# Altium schematic sheet PongSchematic.SchDoc
size A4; CompanyName: HESSO; Address1: Route du Rawyl 47; Address2: 1950 Sion; Address3: Switzerland; PageSetup: Record=PageOptions|CenterHorizontal=True|CenterVertical=True|PrintScale=1.00|XCorrection=1.00|YCorrection=1.00|PrintKind=1|BorderSize=5000000|LeftOffset=0|BottomOffset=0|Orientation=2|PaperLength=1000|PaperWidth=1000|Scale=100|PaperSource=15|PrintQuality=1200|MediaType=1|DitherType=10|PrintScaleMode=1|PaperKind=A4|PaperIndex=9; ProjectName: Project Name
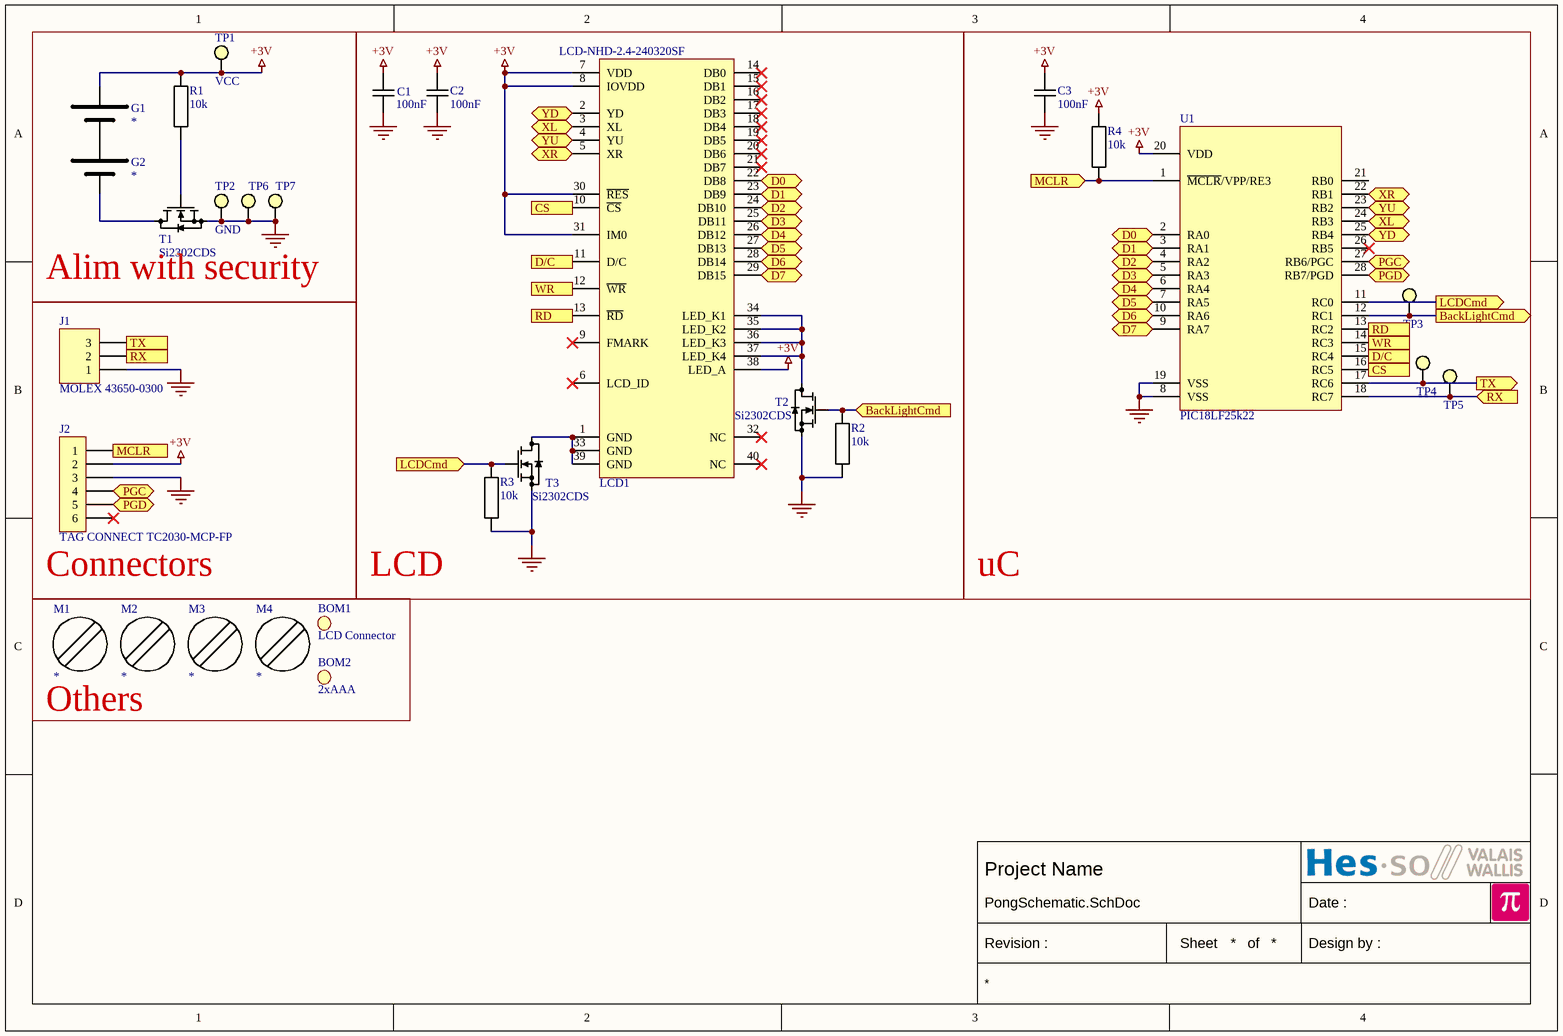
[diagram p0: PongSchematic.SchDoc]

## Parts
BOM1  LCD Connector
BOM2  2xAAA
C1  100nF  [CAPACITOR 2012 REFLOW]
C2  100nF  [CAPACITOR 2012 REFLOW]
C3  100nF  [CAPACITOR 2012 REFLOW]
G1  *  [1.5V Cell AAA/LR03]
G2  *  [1.5V Cell AAA/LR03]
J1  MOLEX 43650-0300  [MOLEX 43650-0300]
J2  TAG CONNECT TC2030-MCP-FP  [TAG CONNECT TC2030-MCP-FP]
LCD1  LCD-NHD-2.4-240320SF  [LCD-NHD-2.4-240320SF]
M1  *  [Screw M3X12 Unconnected]
M2  *  [Screw M3X12 Unconnected]
M3  *  [Screw M3X12 Unconnected]
M4  *  [Screw M3X12 Unconnected]
R1  10k  [RESISTOR 2012 REFLOW]
R2  10k  [RESISTOR 2012 REFLOW]
R3  10k  [RESISTOR 2012 REFLOW]
R4  10k  [RESISTOR 2012 REFLOW]
T1  Si2302CDS  [SOT23 P0.95 C1.6x3.0 H1.3]
T2  Si2302CDS  [SOT23 P0.95 C1.6x3.0 H1.3]
T3  Si2302CDS  [SOT23 P0.95 C1.6x3.0 H1.3]
TP1  VCC  [Pad D2.0]  (no BOM)
TP2  GND  [Pad D2.0]  (no BOM)
TP3  *  [Test Point Vogt 1016L.68M]  (value not drawn)
TP4  *  [Test Point Vogt 1016L.68M]  (value not drawn)
TP5  *  [Test Point Vogt 1016L.68M]  (value not drawn)
TP6  *  [Test Point Vogt 1016L.68M]  (value not drawn)
TP7  *  [Test Point Vogt 1016L.68M]  (value not drawn)
U1  PIC18LF25k22  [SO28 P1.27 C7.5X17.9 H2.7]

## Blocks framed on the sheet
Alim with security: G1 G2 R1 T1 TP1 TP2 TP6 TP7
LCD: C1 C2 LCD1 R2 R3 T2 T3
uC: C3 R4 TP3-TP5 U1
Connectors: J1 J2

## Ports
BackLightCmd (in), BackLightCmd (out), CS (in), CS (out), D0 (bidir), D1 (bidir), D2 (bidir), D3 (bidir), D4 (bidir), D5 (bidir), D6 (bidir), D7 (bidir), D/C (in), D/C (out), LCDCmd (in), LCDCmd (out), MCLR (in), MCLR (out), PGC (bidir), PGD (bidir), RD (in), RD (out), RX (in), RX (out), TX (in), TX (out), WR (in), WR (out), XL (bidir), XR (bidir), YD (bidir), YU (bidir)

## Nets
+3V: C1.2 C2.2 C3.2 G1.1(+) J2.2 LCD1.7(VDD) LCD1.8(IOVDD) LCD1.30(~{RES}) LCD1.31(IM0) LCD1.38(LED_A) R1.2 R4.2 TP1.1 U1.20(VDD)
GND: C1.1 C2.1 C3.1 J1.1 J2.3 R2.1 R3.1 T1.2(S) T2.2(S) T3.2(S) TP2.1 TP6.1 TP7.1 U1.8(VSS) U1.19(VSS)
BackLightCmd: R2.2 T2.1(G) TP3.1 U1.12(RC1) ; port BackLightCmd
CS: LCD1.10(~{CS}) U1.16(RC5) ; port CS
D0: LCD1.22(DB8) U1.2(RA0) ; port D0
D1: LCD1.23(DB9) U1.3(RA1) ; port D1
D2: LCD1.24(DB10) U1.4(RA2) ; port D2
D3: LCD1.25(DB11) U1.5(RA3) ; port D3
D4: LCD1.26(DB12) U1.6(RA4) ; port D4
D5: LCD1.27(DB13) U1.7(RA5) ; port D5
D6: LCD1.28(DB14) U1.10(RA6) ; port D6
D7: LCD1.29(DB15) U1.9(RA7) ; port D7
D/C: LCD1.11(D/C) U1.15(RC4) ; port D/C
LCDCmd: R3.2 T3.1(G) U1.11(RC0) ; port LCDCmd
MCLR: J2.1 R4.1 U1.1(~{MCLR}/VPP/RE3) ; port MCLR
PGC: J2.4 U1.27(RB6/PGC) ; port PGC
PGD: J2.5 U1.28(RB7/PGD) ; port PGD
RD: LCD1.13(~{RD}) U1.13(RC2) ; port RD
RX: J1.2 TP5.1 U1.18(RC7) ; port RX
TX: J1.3 TP4.1 U1.17(RC6) ; port TX
WR: LCD1.12(~{WR}) U1.14(RC3) ; port WR
XL: LCD1.3(XL) U1.24(RB3) ; port XL
XR: LCD1.5(XR) U1.22(RB1) ; port XR
YD: LCD1.2(YD) U1.25(RB4) ; port YD
YU: LCD1.4(YU) U1.23(RB2) ; port YU
NetG1_2: G1.2(—) G2.1(+)
NetG2_2: G2.2(—) T1.3(D)
NetLCD1_1: LCD1.1(GND) LCD1.33(GND) LCD1.39(GND) T3.3(D)
NetLCD1_34: LCD1.34(LED_K1) LCD1.35(LED_K2) LCD1.36(LED_K3) LCD1.37(LED_K4) T2.3(D)
NetR1_1: R1.1 T1.1(G)

Not connected (* = marked no-connect by the designer): J2 6*; LCD1 6(LCD_ID)* 9(FMARK)* 14(DB0)* 15(DB1)* 16(DB2)* 17(DB3)* 18(DB4)* 19(DB5)* 20(DB6)* 21(DB7)* 32(NC)* 40(NC)*; U1 21(RB0) 26(RB5)*

## Notes on the sheet
- Others
- Date :
- Revision :
- Sheet
- of
- Design by :

## Library data of the parts
BOM1 BOM2 = Additional BOM Entry: Component without pattern
  BOM1: Value: LCD Connector
  BOM2: Value: 2xAAA
C1-C3 = Capacitor: Value: *
G1 G2 = Battery: Battery Generic; Value: *
J1 = MOLEX 43650-0300: Micro-Fit 3.0 Right-Angle Header, 3.00mm Pitch, Single Row, 3 Circuits
LCD1 = LCD-NHD-2.4-240320SF: NEWHEAVEN LCD; Value: LCD-NHD-2.4-240320SF
M1-M4 = Screw Unconnected: Screw Unconnected BN330; Value: *
R1-R4 = Resistor: Value: *
T1-T3 = MOS-N SOT23 G-S-D: Generic MOS-N; Value: *
TP1 TP2 = Pad: Value: *
TP3-TP7 = Test Point: Value: *
U1 = PIC18F2_K22-_/SO: Flash Microcontrollers  with 10-Bit A/D and nanoWatt Technology; Value: *